# Altium schematic sheet Power_Tree.SchDoc
size A4; SheetNumber: 1; SheetTotal: 7
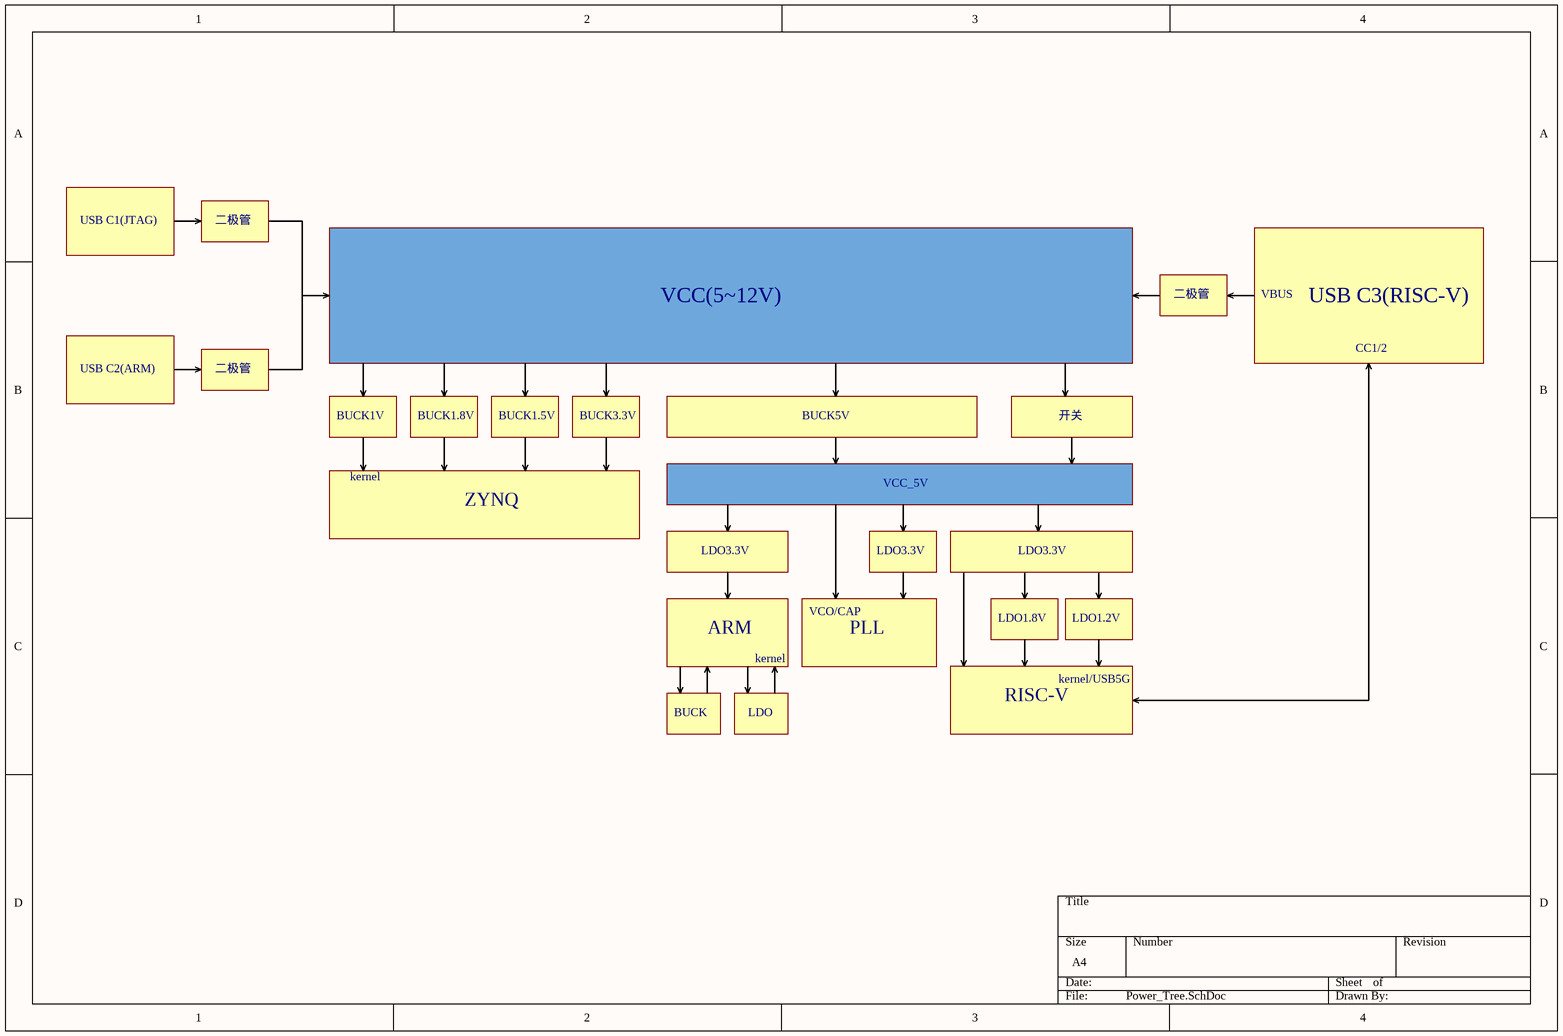
[diagram p0: Power_Tree.SchDoc]

## Notes on the sheet
- USB C1(JTAG)
- 二极管
- VCC(5~12V)
- VBUS
- USB C3(RISC-V)
- USB C2(ARM)
- CC1/2
- BUCK1V
- BUCK1.8V
- BUCK1.5V
- BUCK3.3V
- BUCK5V
- 开关
- kernel
- ZYNQ
- VCC_5V
- LDO3.3V
- ARM
- VCO/CAP
- PLL
- LDO1.8V
- LDO1.2V
- BUCK
- LDO
- RISC-V
- kernel/USB5G